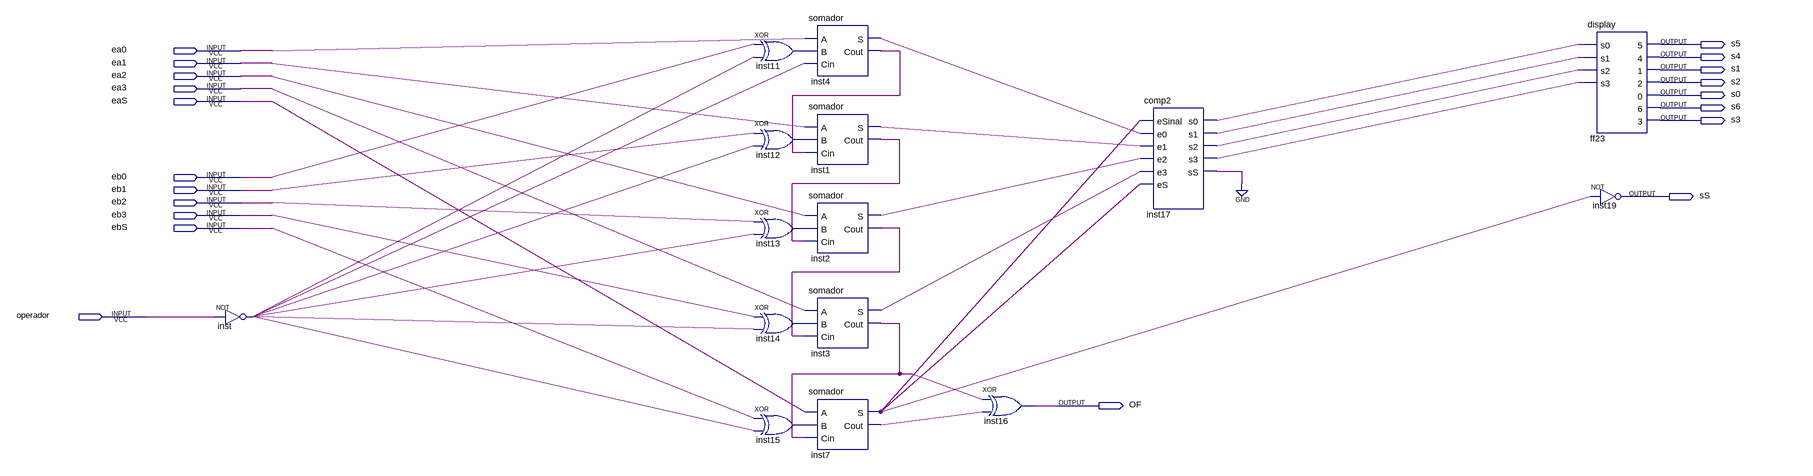
[diagram p0: schematic sheet]
// Quartus schematic somadortotal.bdf as structural Verilog: 15 symbols, 20 pins
module somadortotal (
  input  ea0,
  input  ea1,
  input  ea2,
  input  ea3,
  input  eaS,
  input  eb0,
  input  eb1,
  input  eb2,
  input  eb3,
  input  ebS,
  input  operador,
  output s5,
  output s4,
  output s1,
  output s2,
  output s0,
  output s6,
  output s3,
  output sS,
  output OF
);

  wire inst1_cout, inst1_s, inst2_cout, inst2_s, inst3_cout, inst3_s, inst4_cout, inst4_s, inst7_cout,
       inst7_s, inst11_out, inst12_out, inst13_out, inst14_out, inst15_out, inst17_s0, inst17_s1, inst17_s2,
       inst17_s3, inst17_ss, inst_out;

  not inst (inst_out, operador);
  xor inst11 (inst11_out, eb0, inst_out);
  xor inst12 (inst12_out, eb1, inst_out);
  xor inst13 (inst13_out, eb2, inst_out);
  xor inst14 (inst14_out, eb3, inst_out);
  xor inst15 (inst15_out, ebS, inst_out);
  somador inst4 (.A(ea0), .B(inst11_out), .Cin(inst_out), .S(inst4_s), .Cout(inst4_cout));
  somador inst1 (.A(ea1), .B(inst12_out), .Cin(inst4_cout), .S(inst1_s), .Cout(inst1_cout));
  somador inst2 (.A(ea2), .B(inst13_out), .Cin(inst1_cout), .S(inst2_s), .Cout(inst2_cout));
  somador inst3 (.A(ea3), .B(inst14_out), .Cin(inst2_cout), .S(inst3_s), .Cout(inst3_cout));
  somador inst7 (.A(eaS), .B(inst15_out), .Cin(inst3_cout), .S(inst7_s), .Cout(inst7_cout));
  xor inst16 (OF, inst3_cout, inst7_cout);
  comp2 inst17 (
    .eSinal(inst7_s), .e0(inst4_s), .e1(inst1_s), .e2(inst2_s), .e3(inst3_s), .eS(inst7_s), .s0(inst17_s0),
    .s1(inst17_s1), .s2(inst17_s2), .s3(inst17_s3), .sS(inst17_ss));
  display ff23 (
    .s0(inst17_s0), .s1(inst17_s1), .s2(inst17_s2), .s3(inst17_s3), .\5 (s5), .\4 (s4), .\1 (s1), .\2 (s2),
    .\0 (s0), .\6 (s6), .\3 (s3));
  not inst19 (sS, inst7_s);
  // also tied to GND on the sheet: inst17_ss
endmodule
